# Altium project ife18_TS_BMS_Master_STM32.PrjPcb
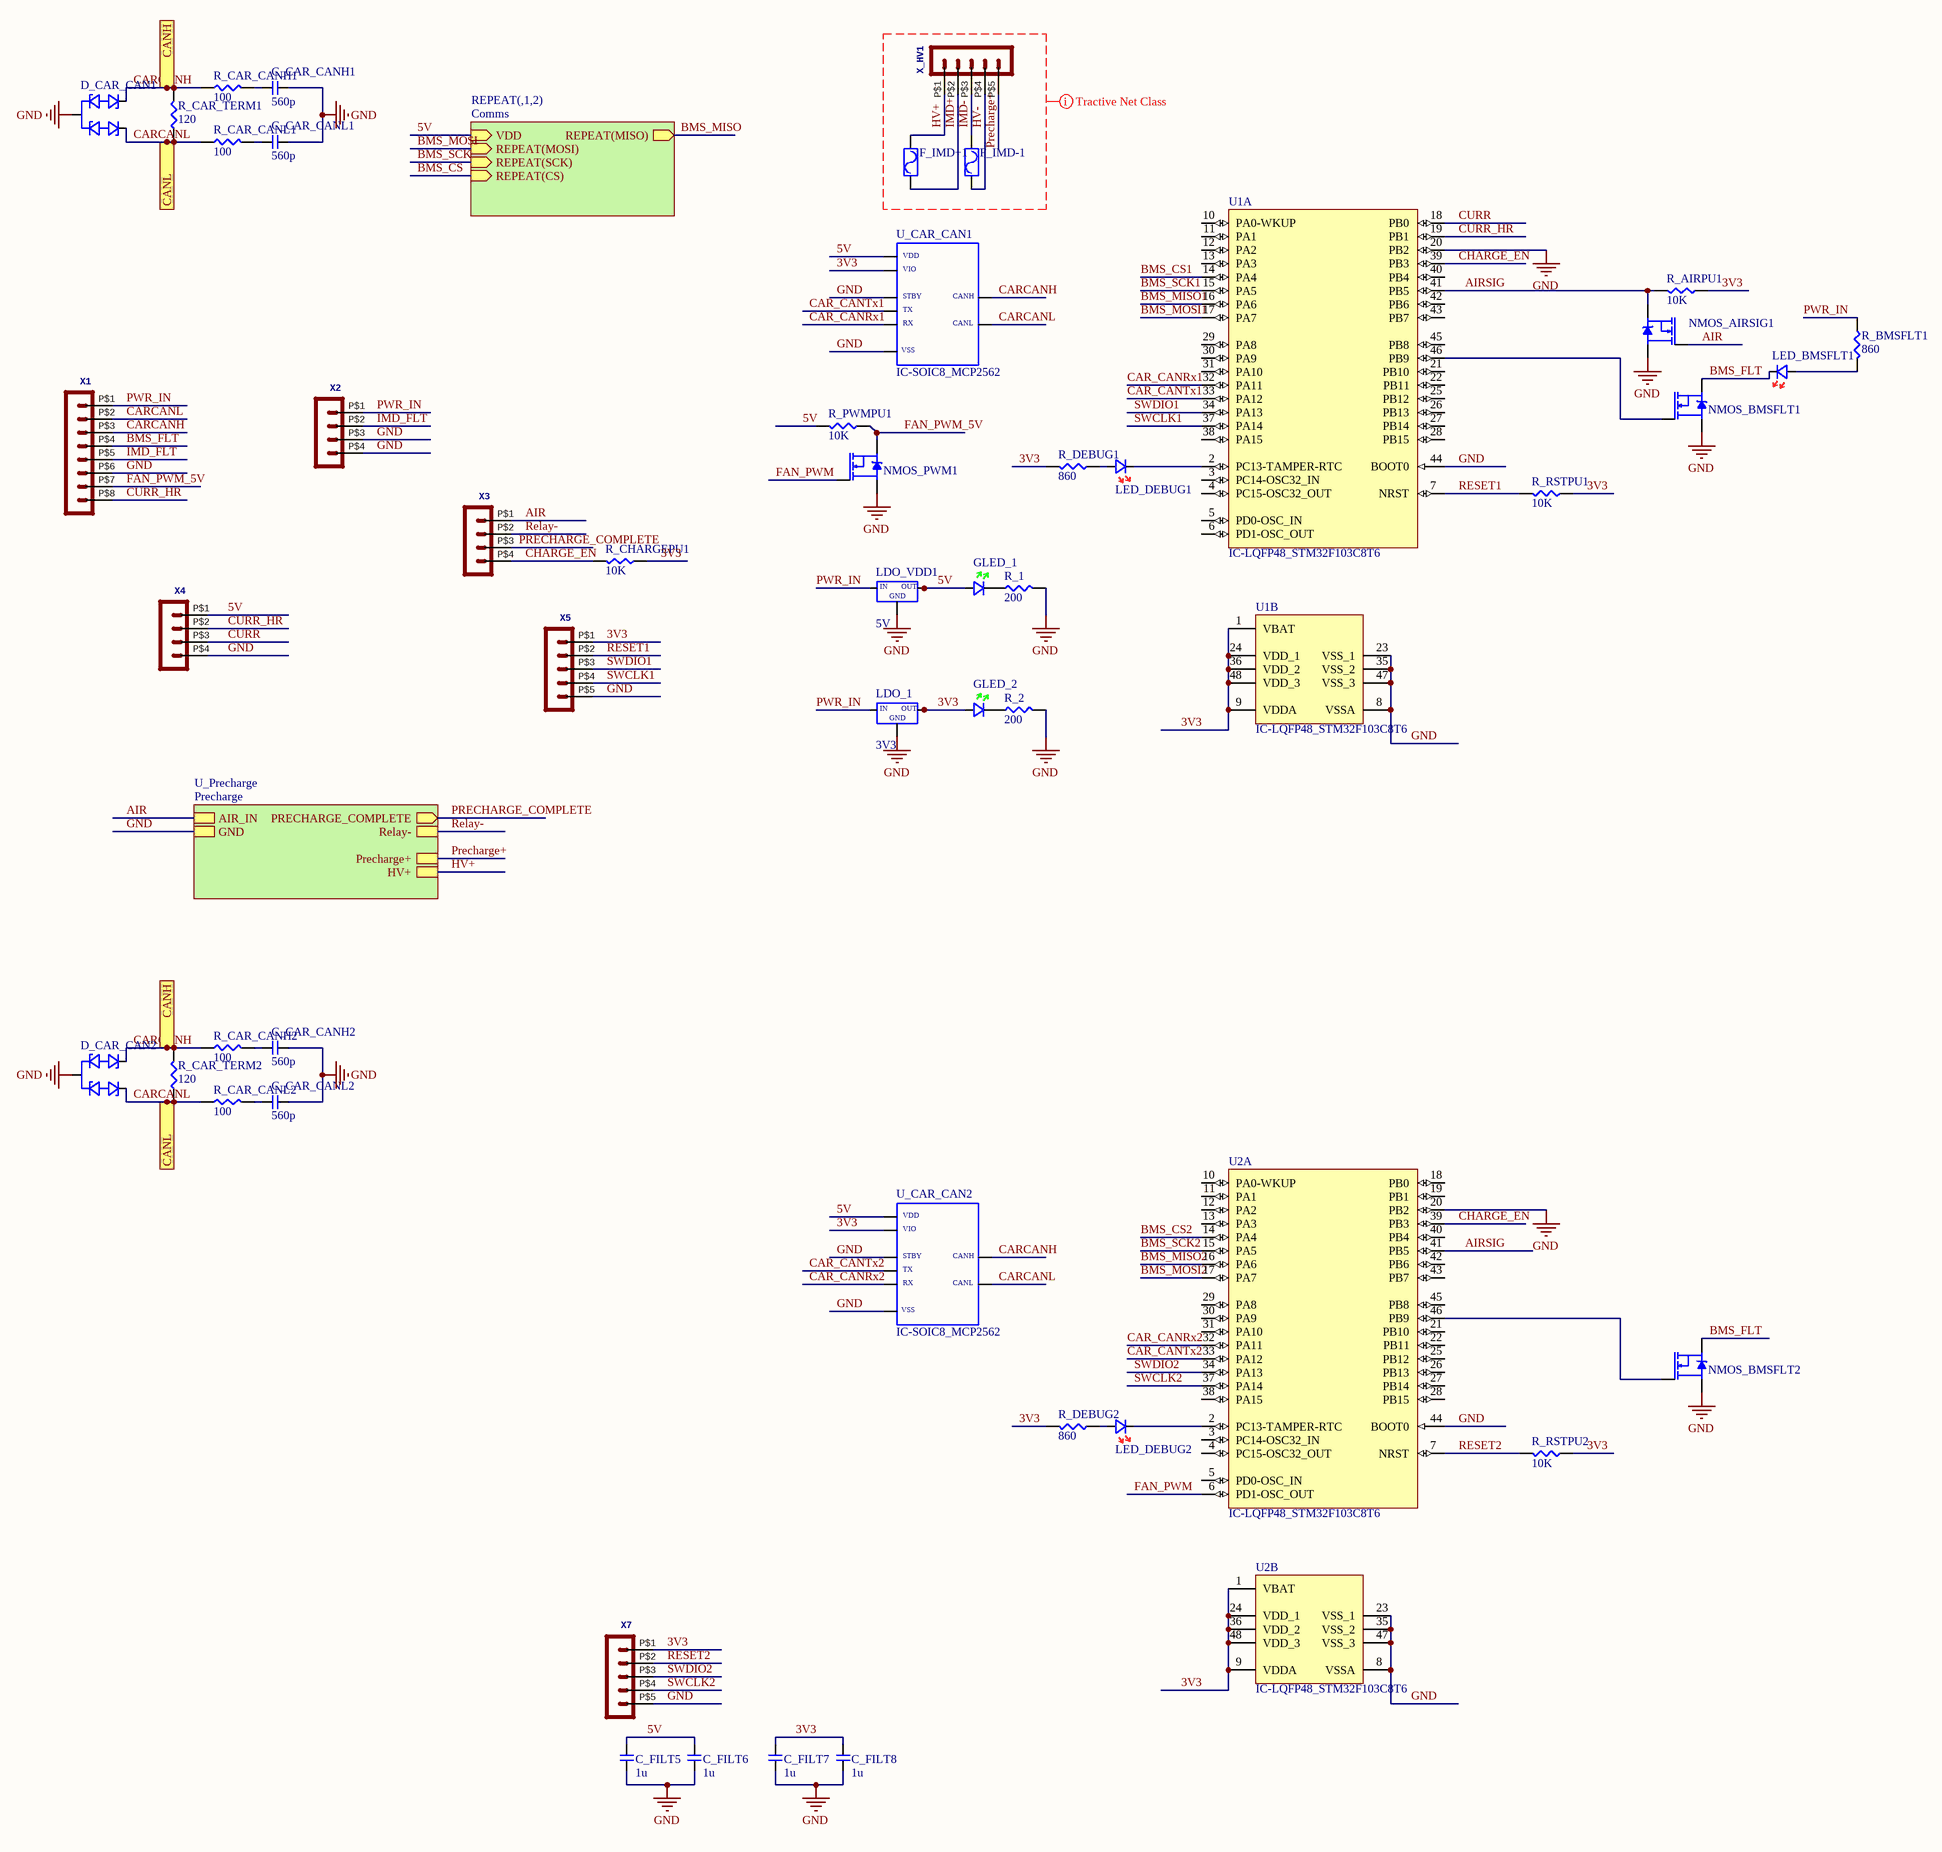
[diagram p0: Master.SchDoc]
3 sheets, 91 parts. Net scope: hierarchical (ports join the sheet entries above them; power ports are global).
Board file: ife18_TS_BMS_Master_STM32.PcbDoc
Sheets:
  Master.SchDoc
    1 = Comms.SchDoc
    2 = Comms.SchDoc
    U_Precharge = Precharge.SchDoc

## Sheet Master.SchDoc
size C

### Parts
C_CAR_CANH1  560p  [CAP-0603]
C_CAR_CANH2  560p  [CAP-0603]
C_CAR_CANL1  560p  [CAP-0603]
C_CAR_CANL2  560p  [CAP-0603]
C_FILT5  1u  [CAP-0603]
C_FILT6  1u  [CAP-0603]
C_FILT7  1u  [CAP-0603]
C_FILT8  1u  [CAP-0603]
D_CAR_CAN1  DIODE-SOT23_PESD1CAN  [SOT23]  (value not drawn)
D_CAR_CAN2  DIODE-SOT23_PESD1CAN  [SOT23]  (value not drawn)
F_IMD+1  FUSE_885  [FUSE_885]  (value not drawn)
F_IMD-1  FUSE_885  [FUSE_885]  (value not drawn)
GLED_1  (no value)  [LEDGREEN-0603]
GLED_2  (no value)  [LEDGREEN-0603]
LDO_1  3V3  [SOT223]
LDO_VDD1  5V  [SOT223]
LED_BMSFLT1  LEDRED-0603  [LEDRED-0603]  (value not drawn)
LED_DEBUG1  LEDRED-0603  [LEDRED-0603]  (value not drawn)
LED_DEBUG2  LEDRED-0603  [LEDRED-0603]  (value not drawn)
NMOS_AIRSIG1  NMOS-SOT23  [SOT23]  (value not drawn)
NMOS_BMSFLT1  NMOS-SOT23  [SOT23]  (value not drawn)
NMOS_BMSFLT2  NMOS-SOT23  [SOT23]  (value not drawn)
NMOS_PWM1  NMOS-SOT23  [SOT23]  (value not drawn)
R_1  200  [RES-0603]
R_2  200  [RES-0603]
R_AIRPU1  10K  [RES-0603]
R_BMSFLT1  860  [RES-0603]
R_CAR_CANH1  100  [RES-0603]
R_CAR_CANH2  100  [RES-0603]
R_CAR_CANL1  100  [RES-0603]
R_CAR_CANL2  100  [RES-0603]
R_CAR_TERM1  120  [RES-0603]
R_CAR_TERM2  120  [RES-0603]
R_CHARGEPU1  10K  [RES-0603]
R_DEBUG1  860  [RES-0603]
R_DEBUG2  860  [RES-0603]
R_PWMPU1  10K  [RES-0603]
R_RSTPU1  10K  [RES-0603]
R_RSTPU2  10K  [RES-0603]
U1  IC-LQFP48_STM32F103C8T6  [STM-LQFP48_M]  (parts A,B of 2)
U2  IC-LQFP48_STM32F103C8T6  [STM-LQFP48_M]  (parts A,B of 2)
U_CAR_CAN1  IC-SOIC8_MCP2562  [SOIC8]
U_CAR_CAN2  IC-SOIC8_MCP2562  [SOIC8]
X1  Molex - Micro-Fit 3.0 Series connector,  3.00mm (0.118") pitch header, 8 positions.  [43650-0824]  (value not drawn)
X2  Molex - Micro-Fit 3.0 Series connector,  3.00mm (0.118") pitch header, 4 positions.  [43650-0424]  (value not drawn)
X3  Molex - Micro-Fit 3.0 Series connector,  3.00mm (0.118") pitch header, 4 positions.  [43650-0424]  (value not drawn)
X4  Molex - Micro-Fit 3.0 Series connector,  3.00mm (0.118") pitch header, 4 positions.  [43650-0424]  (value not drawn)
X5  (no value)  [POS5_254MM_MALE]
X7  (no value)  [POS5_254MM_MALE]
X_HV1  Molex - Micro-Fit 3.0 Series connector,  3.00mm (0.118") pitch header, 5 positions.  [43650-0524]  (value not drawn)

### Sub-sheets
REPEAT(,1,2) = Comms: VDD (in), REPEAT(MOSI) (in), REPEAT(MISO) (out), REPEAT(SCK) (in), REPEAT(CS) (in)
U_Precharge = Precharge: PRECHARGE_COMPLETE (out), AIR_IN, GND, Precharge+, HV+, Relay-

### Ports
CANH, CANL

### Nets
AIR: NMOS_AIRSIG1.1(G) X3.P$1 ; sheet U_Precharge/AIR_IN
GND: C_CAR_CANH1.2 C_CAR_CANH2.2 C_CAR_CANL1.2 C_CAR_CANL2.2 C_FILT5.1 C_FILT6.1 C_FILT7.1 C_FILT8.1 D_CAR_CAN1.3(G) D_CAR_CAN2.3(G) LDO_1.1 LDO_VDD1.1 NMOS_AIRSIG1.2(S) NMOS_BMSFLT1.2(S) NMOS_BMSFLT2.2(S) NMOS_PWM1.2(S) R_1.2 R_2.2 U1.8(VSSA) U1.20(PB2) U1.23(VSS_1) U1.35(VSS_2) U1.44(BOOT0) U1.47(VSS_3) U2.8(VSSA) U2.20(PB2) U2.23(VSS_1) U2.35(VSS_2) U2.44(BOOT0) U2.47(VSS_3) U_CAR_CAN1.2 U_CAR_CAN1.8 U_CAR_CAN2.2 U_CAR_CAN2.8 X1.P$6 X2.P$3 X2.P$4 X4.P$4 X5.P$5 X7.P$5 ; sheet U_Precharge/GND
3V3: C_FILT7.2 C_FILT8.2 GLED_2.A LDO_1.2 LDO_1.4 R_AIRPU1.1 R_CHARGEPU1.1 R_DEBUG1.2 R_DEBUG2.2 R_RSTPU1.1 R_RSTPU2.1 U1.1(VBAT) U1.9(VDDA) U1.24(VDD_1) U1.36(VDD_2) U1.48(VDD_3) U2.1(VBAT) U2.9(VDDA) U2.24(VDD_1) U2.36(VDD_2) U2.48(VDD_3) U_CAR_CAN1.5 U_CAR_CAN2.5 X5.P$1 X7.P$1
5V: C_FILT5.2 C_FILT6.2 GLED_1.A LDO_VDD1.2 LDO_VDD1.4 R_PWMPU1.1 U_CAR_CAN1.3 U_CAR_CAN2.3 X4.P$1 ; sheet REPEAT(,1,2)/VDD
AIRSIG: NMOS_AIRSIG1.3(D) R_AIRPU1.2 U1.41(PB5) U2.41(PB5)
BMS_CS: sheet REPEAT(,1,2)/REPEAT(CS)
BMS_CS1: U1.14(PA4)
BMS_CS2: U2.14(PA4)
BMS_FLT: LED_BMSFLT1.K NMOS_BMSFLT1.3(D) NMOS_BMSFLT2.3(D) X1.P$4
BMS_MISO: sheet REPEAT(,1,2)/REPEAT(MISO)
BMS_MISO1: U1.16(PA6)
BMS_MISO2: U2.16(PA6)
BMS_MOSI: sheet REPEAT(,1,2)/REPEAT(MOSI)
BMS_MOSI1: U1.17(PA7)
BMS_MOSI2: U2.17(PA7)
BMS_SCK: sheet REPEAT(,1,2)/REPEAT(SCK)
BMS_SCK1: U1.15(PA5)
BMS_SCK2: U2.15(PA5)
CAR_CANRx1: U1.32(PA11) U_CAR_CAN1.4
CAR_CANRx2: U2.32(PA11) U_CAR_CAN2.4
CAR_CANTx1: U1.33(PA12) U_CAR_CAN1.1
CAR_CANTx2: U2.33(PA12) U_CAR_CAN2.1
CARCANH: D_CAR_CAN1.2(CAN2) D_CAR_CAN2.2(CAN2) R_CAR_CANH1.1 R_CAR_CANH2.1 R_CAR_TERM1.2 R_CAR_TERM2.2 U_CAR_CAN1.7 U_CAR_CAN2.7 X1.P$3 ; port CANH
CARCANL: D_CAR_CAN1.1(CAN1) D_CAR_CAN2.1(CAN1) R_CAR_CANL1.1 R_CAR_CANL2.1 R_CAR_TERM1.1 R_CAR_TERM2.1 U_CAR_CAN1.6 U_CAR_CAN2.6 X1.P$2 ; port CANL
CHARGE_EN: R_CHARGEPU1.2 U1.39(PB3) U2.39(PB3) X3.P$4
CURR: U1.18(PB0) X4.P$3
CURR_HR: U1.19(PB1) X1.P$8 X4.P$2
FAN_PWM: NMOS_PWM1.1(G) U2.6(PD1-OSC_OUT)
FAN_PWM_5V: NMOS_PWM1.3(D) R_PWMPU1.2 X1.P$7
HV+: F_IMD+1.1 X_HV1.P$1 ; sheet U_Precharge/HV+
HV-: F_IMD-1.2 X_HV1.P$4
IMD+: F_IMD+1.2 X_HV1.P$2
IMD-: F_IMD-1.1 X_HV1.P$3
IMD_FLT: X1.P$5 X2.P$2
Precharge+: X_HV1.P$5 ; sheet U_Precharge/Precharge+
PRECHARGE_COMPLETE: X3.P$3 ; sheet U_Precharge/PRECHARGE_COMPLETE
PWR_IN: LDO_1.3 LDO_VDD1.3 R_BMSFLT1.2 X1.P$1 X2.P$1
Relay-: X3.P$2 ; sheet U_Precharge/Relay-
RESET1: R_RSTPU1.2 U1.7(NRST) X5.P$2
RESET2: R_RSTPU2.2 U2.7(NRST) X7.P$2
SWCLK1: U1.37(PA14) X5.P$4
SWCLK2: U2.37(PA14) X7.P$4
SWDIO1: U1.34(PA13) X5.P$3
SWDIO2: U2.34(PA13) X7.P$3
NetC_CAR_CANH1_1: C_CAR_CANH1.1 R_CAR_CANH1.2
NetC_CAR_CANH2_1: C_CAR_CANH2.1 R_CAR_CANH2.2
NetC_CAR_CANL1_1: C_CAR_CANL1.1 R_CAR_CANL1.2
NetC_CAR_CANL2_1: C_CAR_CANL2.1 R_CAR_CANL2.2
NetGLED_1_K: GLED_1.K R_1.1
NetGLED_2_K: GLED_2.K R_2.1
NetLED_BMSFLT1_A: LED_BMSFLT1.A R_BMSFLT1.1
NetLED_DEBUG1_A: LED_DEBUG1.A R_DEBUG1.1
NetLED_DEBUG1_K: LED_DEBUG1.K U1.2(PC13-TAMPER-RTC)
NetLED_DEBUG2_A: LED_DEBUG2.A R_DEBUG2.1
NetLED_DEBUG2_K: LED_DEBUG2.K U2.2(PC13-TAMPER-RTC)
NetNMOS_BMSFLT1_1: NMOS_BMSFLT1.1(G) U1.46(PB9)
NetNMOS_BMSFLT2_1: NMOS_BMSFLT2.1(G) U2.46(PB9)

Not connected (* = marked no-connect by the designer): U1 3(PC14-OSC32_IN) 4(PC15-OSC32_OUT) 5(PD0-OSC_IN) 6(PD1-OSC_OUT) 10(PA0-WKUP) 11(PA1) 12(PA2) 13(PA3) 21(PB10) 22(PB11) 25(PB12) 26(PB13) 27(PB14) 28(PB15) 29(PA8) 30(PA9) 31(PA10) 38(PA15) 40(PB4) 42(PB6) 43(PB7) 45(PB8); U2 3(PC14-OSC32_IN) 4(PC15-OSC32_OUT) 5(PD0-OSC_IN) 10(PA0-WKUP) 11(PA1) 12(PA2) 13(PA3) 18(PB0) 19(PB1) 21(PB10) 22(PB11) 25(PB12) 26(PB13) 27(PB14) 28(PB15) 29(PA8) 30(PA9) 31(PA10) 38(PA15) 40(PB4) 42(PB6) 43(PB7) 45(PB8)

### Layout directives
net class Tractive: HV+, HV-, IMD+, IMD-, Precharge+

### Notes on the sheet
- (in symbol IC-SOIC8_MCP2562) VDD; VIO; STBY; CANH; TX; RX; CANL; VSS
- (in symbol LDO-SOT223_SPX1117) IN; OUT; GND

### Library data of the parts
C_CAR_CANH1 C_CAR_CANH2 C_CAR_CANL1 C_CAR_CANL2 C_FILT5-C_FILT8 = CAP-0603
GLED_1 GLED_2 = LEDGREEN-0603
LDO_1 LDO_VDD1 = LDO-SOT223_SPX1117
R_1 R_2 R_AIRPU1 R_BMSFLT1 R_CAR_CANH1 R_CAR_CANH2 R_CAR_CANL1 R_CAR_CANL2 R_CAR_TERM1 R_CAR_TERM2 R_CHARGEPU1 R_DEBUG1 R_DEBUG2 R_PWMPU1 R_RSTPU1 R_RSTPU2 = RES-0603
U1 U2 = IC-LQFP48_STM32F103C8T6: A/D Converter: 2x12-bit (10 Channel); Core: ARM Cortex-M3; FLASH Size (Prog) (kB): 64; I/Os (High Current): 37; Internal RAM Size (kB): 20; Operating Frequency(F) (Processor speed) (MHz): 72; Packing: Tray; Supply Voltage(Vcc) min (V): 2; DatasheetVersion: Rev. 16; PackageVersion: Rev. 6, 06/2013; PackageReference: LQFP48; PackageDescription: 48-Pin Low Profile Quad Flat Package, 7 x 7 mm Body, 0.5 mm Pitch; Supplier 1: Digi-Key; Supplier Part Number 1: 497-6063-ND; Supplier 2: Farnell; Supplier Part Number 2: 1447637; Supplier 3: Newark; Supplier Part Number 3: 59M2182; Supplier 4: Newark; Supplier Part Number 4: 57P1222; Supplier 5: Mouser; Supplier Part Number 5: 511-STM32F103C8T6; Mounting Technology: Surface Mount; PartNumber: STM32F103C8T6; ComponentLink1Description: Manufacturer URL; ComponentLink1URL: http://www.st.com/web/en/home.html; ComponentLink2Description: Datasheet; ComponentLink2URL: http://www.st.com/st-web-ui/static/active/en/resource/technical/document/datasheet/CD00161566.pdf; ComponentLink3Description: Package Specification; ComponentLink3URL: http://www.st.com/st-web-ui/static/active/en/resource/technical/document/datasheet/DM00058181.pdf
X1 = HEADER_POS8_?43650-0824: GateName_1: G$1; SymbolName_1: HEADER_POS8; DeviceName: 43650-0824; LibraryName: MOLEX Micro-Fit; DeviceSetName: HEADER_POS8_?; Package: 43650-0824
X2-X4 = POS4_MF43650-0424: GateName_1: G$1; SymbolName_1: HEADER_POS4; DeviceSetName: HEADER_POS4_?; DeviceName: 43650-0424; LibraryName: MOLEX Micro-Fit; Package: 43650-0424
X5 X7 = POS5_254MM_MALE: GateName_1: G$1; SymbolName_1: HEADER_POS5; DeviceName: 43650-0524; DeviceSetName: HEADER_POS5_?; LibraryName: MOLEX Micro-Fit; Package: 43650-0524
X_HV1 = POS5_MF43650-0524: GateName_1: G$1; SymbolName_1: HEADER_POS5; DeviceSetName: HEADER_POS5_?; DeviceName: 43650-0524; LibraryName: MOLEX Micro-Fit; Package: 43650-0524

## Sheet Comms.SchDoc
size A
Used 2 times, as channels 1, 2. Parts and nets are listed once, with the designators drawn on the sheet.
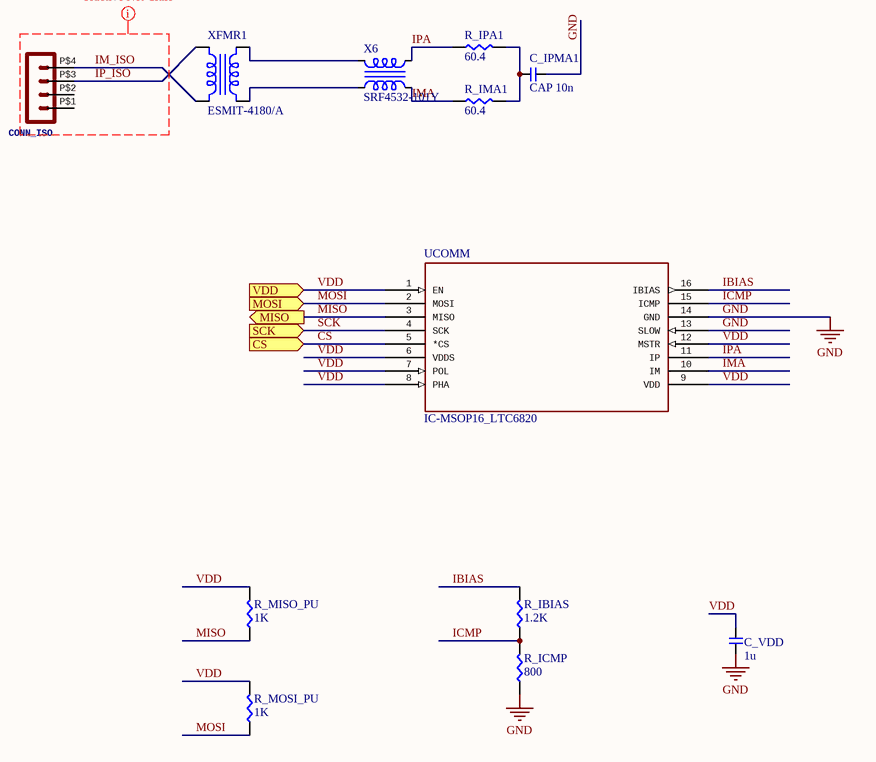
[diagram p1: Comms.SchDoc]

### Parts
C_IPMA1  CAP 10n  [CAP-0603]
C_VDD  1u  [CAP-0603]
CONN_ISO  Molex - Micro-Fit 3.0 Series connector,  3.00mm (0.118") pitch header, 4 positions.  [43650-0424]  (value not drawn)
R_IBIAS  1.2K  [RES-0603]
R_ICMP  800  [RES-0603]
R_IMA1  60.4  [RES-0603]
R_IPA1  60.4  [RES-0603]
R_MISO_PU  1K  [RES-0603]
R_MOSI_PU  1K  [RES-0603]
UCOMM  IC-MSOP16_LTC6820  [MSOP16]
X6  SRF4532-101Y  [SRF4532]
XFMR1  ESMIT-4180/A  [ISOXFMR_ESMIT4180]

### Ports
CS (in), MISO (out), MOSI (in), SCK (in), VDD (in)

### Nets
GND: C_IPMA1.1 C_VDD.1 R_ICMP.1 UCOMM.13(SLOW) UCOMM.14(GND)
CS: UCOMM.5(*CS) ; port CS
IBIAS: R_IBIAS.2 UCOMM.16(IBIAS)
ICMP: R_IBIAS.1 R_ICMP.2 UCOMM.15(ICMP)
IM_ISO: CONN_ISO.P$4 XFMR1.1
IMA: R_IMA1.2 UCOMM.10(IM) X6.1
IP_ISO: CONN_ISO.P$3 XFMR1.2
IPA: R_IPA1.2 UCOMM.11(IP) X6.4
MISO: R_MISO_PU.1 UCOMM.3(MISO) ; port MISO
MOSI: R_MOSI_PU.1 UCOMM.2(MOSI) ; port MOSI
SCK: UCOMM.4(SCK) ; port SCK
VDD: C_VDD.2 R_MISO_PU.2 R_MOSI_PU.2 UCOMM.1(EN) UCOMM.6(VDDS) UCOMM.7(POL) UCOMM.8(PHA) UCOMM.9(VDD) UCOMM.12(MSTR) ; port VDD
NetC_IPMA1_2: C_IPMA1.2 R_IMA1.1 R_IPA1.1
NetX6_2: X6.2 XFMR1.4
NetX6_3: X6.3 XFMR1.3

Not connected (* = marked no-connect by the designer): CONN_ISO P$1(1) P$2(2)

### Channels
1: designators end in _1; ports CS=BMS_CS1 MISO=BMS_MISO1 MOSI=BMS_MOSI1 SCK=BMS_SCK1 VDD=5V
2: designators end in _2; ports CS=BMS_CS2 MISO=BMS_MISO2 MOSI=BMS_MOSI2 SCK=BMS_SCK2 VDD=5V

### Layout directives
net class Tractive: IM_ISO, IP_ISO

### Library data of the parts
C_IPMA1 C_VDD = CAP-0603
CONN_ISO = POS4_MF43650-0424: as X2 on sheet Master; DeviceName: 43650-0424; LibraryName: MOLEX Micro-Fit; Package: 43650-0424
R_IBIAS R_ICMP R_IMA1 R_IPA1 R_MISO_PU R_MOSI_PU = RES-0603
X6 = CMC_SRF4532
XFMR1 = ISOXFMR_ESMIT4180

## Sheet Precharge.SchDoc: Precharge
size 241 x 127 mm; Date: 1/4/2019 10:42:01 PM; SheetNumber: 1; GateName_1: G$1; SymbolName_1: LETTER_L; LibraryName: frames; DeviceSetName: LETTER_L; GateName_2: G$2; SymbolName_2: DOCFIELD
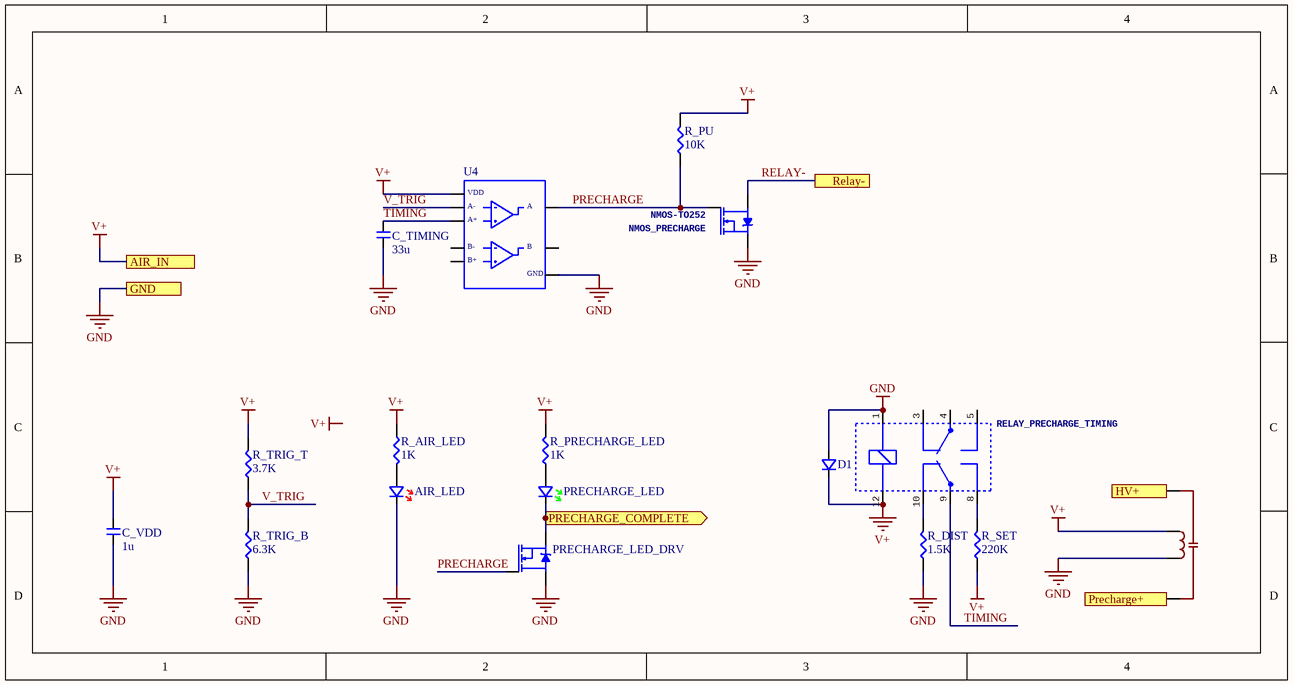
[diagram p2: Precharge.SchDoc]

### Parts
AIR_LED  (no value)  [LEDRED-0603]
C_TIMING  33u  [CAP-0603]
C_VDD  1u  [CAP-0603]
D1  (no value)  [DO41-10]
NMOS_PRECHARGE  NMOS-TO252  [TO252]
PRECHARGE_LED  (no value)  [LEDGREEN-0603]
PRECHARGE_LED_DRV  (no value)  [SOT23]
R_AIR_LED  1K  [RES-0603]
R_DIST  1.5K  [RES-0603]
R_PRECHARGE_LED  1K  [RES-0603]
R_PU  10K  [RES-0603]
R_SET  220K  [RES-0603]
R_TRIG_B  6.3K  [RES-0603]
R_TRIG_T  3.7K  [RES-0603]
RELAY_PRECHARGE  COTO9104  [9104-SIP4]  (value not drawn)
RELAY_PRECHARGE_TIMING  (no value)  [RELAY-DPDT_EC2]
U4  (no value)  [SOIC8]

### Ports
AIR_IN, GND, HV+, Precharge+, PRECHARGE_COMPLETE (out), Relay-

### Nets
GND: AIR_LED.K C_TIMING.1 C_VDD.1 D1.A NMOS_PRECHARGE.3(D) PRECHARGE_LED_DRV.2(S) R_DIST.2 R_TRIG_B.1 RELAY_PRECHARGE.5 RELAY_PRECHARGE_TIMING.1 U4.4 ; port GND
V+: C_VDD.2 D1.K R_AIR_LED.1 R_PRECHARGE_LED.2 R_PU.2 R_SET.2 R_TRIG_T.2 RELAY_PRECHARGE.3 RELAY_PRECHARGE_TIMING.12 U4.8 ; port AIR_IN  [project net AIR]
HV+: RELAY_PRECHARGE.1 ; port HV+
PRECHARGE: NMOS_PRECHARGE.1(G) PRECHARGE_LED_DRV.1(G) R_PU.1 U4.1
Precharge+: RELAY_PRECHARGE.7 ; port Precharge+
PRECHARGE_COMPLETE: PRECHARGE_LED.K PRECHARGE_LED_DRV.3(D) ; port PRECHARGE_COMPLETE
Relay-: NMOS_PRECHARGE.2(S) ; port Relay-
TIMING: C_TIMING.2 RELAY_PRECHARGE_TIMING.9 U4.3
V_TRIG: R_TRIG_B.2 R_TRIG_T.1 U4.2
NetAIR_LED_A: AIR_LED.A R_AIR_LED.2
NetPRECHARGE_LED_A: PRECHARGE_LED.A R_PRECHARGE_LED.1
NetR_DIST_1: R_DIST.1 RELAY_PRECHARGE_TIMING.10
NetR_SET_1: R_SET.1 RELAY_PRECHARGE_TIMING.8

Not connected (* = marked no-connect by the designer): RELAY_PRECHARGE_TIMING 3 4 5; U4 5 6 7

### Notes on the sheet
- Labels drawn without touching a wire or pin: V+
- Title
- Size:
- Date:
- A
- Number:
- Time:
- Revision:
- Sheet
- of
- File:
- (in symbol IC-SOIC8_LM393) VDD; A-; A; A+; B-; B; B+; GND

### Library data of the parts
AIR_LED = LEDRED-0603
C_TIMING C_VDD = CAP-0603
D1 = DIODE-DO41-10
NMOS_PRECHARGE = NMOS-TO252: GateName_1: G$1; SymbolName_1: LABELED-PMOS; DeviceSetName: DMP10H400SK3-13; LibraryName: IFE_Transistors; Package: TO252
PRECHARGE_LED = LEDGREEN-0603
PRECHARGE_LED_DRV = NMOS-SOT23
R_AIR_LED R_DIST R_PRECHARGE_LED R_PU R_SET R_TRIG_B R_TRIG_T = RES-0603
RELAY_PRECHARGE = COTO9104: GateName_1: G$1; SymbolName_1: SPST_REED; LibraryName: Discharge_Components_Altium_Export; DeviceSetName: COTO9104; Package: 9104-SIP4
RELAY_PRECHARGE_TIMING = RELAY_EC2: GateName_1: G$1; SymbolName_1: MONOSTABLERELAY; DeviceSetName: EC2; LibraryName: KEMET; Package: DPDT_2.54
U4 = IC-SOIC8_LM393

## Nets that join several sheets
AIR: Master (NMOS_AIRSIG1.1 X3.P$1), Precharge (10 pins)
GND: Master (40 pins), 1 (5 pins), 2 (5 pins), Precharge (11 pins)
5V: Master (9 pins), 1 (9 pins), 2 (9 pins)
BMS_CS1: Master (U1.14), 1 (UCOMM_1.5)
BMS_CS2: Master (U2.14), 2 (UCOMM_2.5)
BMS_MISO1: Master (U1.16), 1 (R_MISO_PU_1.1 UCOMM_1.3)
BMS_MISO2: Master (U2.16), 2 (R_MISO_PU_2.1 UCOMM_2.3)
BMS_MOSI1: Master (U1.17), 1 (R_MOSI_PU_1.1 UCOMM_1.2)
BMS_MOSI2: Master (U2.17), 2 (R_MOSI_PU_2.1 UCOMM_2.2)
BMS_SCK1: Master (U1.15), 1 (UCOMM_1.4)
BMS_SCK2: Master (U2.15), 2 (UCOMM_2.4)
HV+: Master (F_IMD+1.1 X_HV1.P$1), Precharge (RELAY_PRECHARGE.1)
Precharge+: Master (X_HV1.P$5), Precharge (RELAY_PRECHARGE.7)
PRECHARGE_COMPLETE: Master (X3.P$3), Precharge (PRECHARGE_LED.K PRECHARGE_LED_DRV.3)
Relay-: Master (X3.P$2), Precharge (NMOS_PRECHARGE.2)